# Altium project UCC28180_Power System_V05.PrjPcb
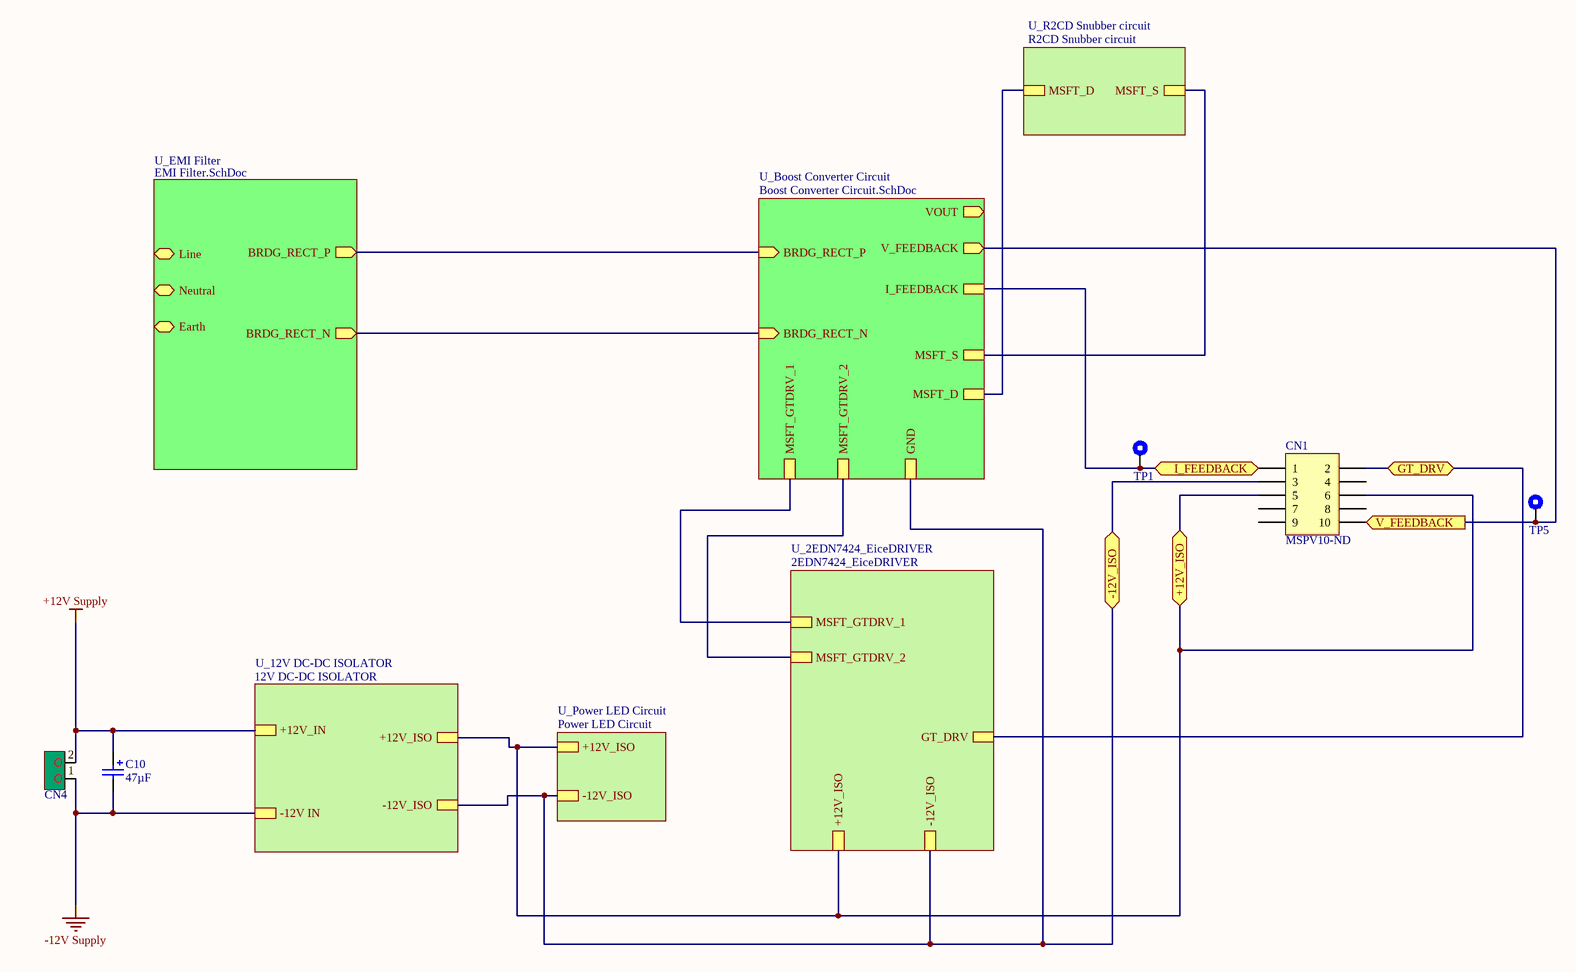
[diagram p0: Top Sheet_Power System.SchDoc]
ApproverName: Approver Name; Author: Name; Document_number: 14-003-DD-_ _-V01; ProjectName/Number: T800, PMLS-14-003; Revision: A; Title: Set the title in project options
3 sheets, 46 parts. Net scope: strictly hierarchical (ports join the sheet entries above them; power ports are local).
Board file: UCC28180_Power Board.PcbDoc
Sheets:
  Top Sheet_Power System.SchDoc
    U_EMI Filter = EMI Filter.SchDoc
    U_Boost Converter Circuit = Boost Converter Circuit.SchDoc

## Sheet Top Sheet_Power System.SchDoc: Set the title in project options
size B; Author: Name; Organization: Altium Limited; Address1: L3, 12a Rodborough Rd; Address2: Frenchs Forest; Address3: NSW; Address4: Australia 2086; Revision: A; SheetNumber: 1; SheetTotal: 1

### Parts
C10  Capacitance: 47µF  [CAPALUM47U]  (hidden comment: ECA-1VM470)
CN1  MSPV10-ND  [MSV10-ND]
CN4  1935776  [CONN_1935776]  (value not drawn)
TP1  5006  [Test Point]  (value not drawn)
TP5  5006  [Test Point]  (value not drawn)

### Sub-sheets
U_2EDN7424_EiceDRIVER = 2EDN7424_EiceDRIVER (file not in this document): MSFT_GTDRV_1, MSFT_GTDRV_2, GT_DRV, -12V_ISO, +12V_ISO
U_12V DC-DC ISOLATOR = 12V DC-DC ISOLATOR (file not in this document): -12V_ISO, +12V_ISO, -12V IN, +12V_IN
U_Boost Converter Circuit = Boost Converter Circuit.SchDoc: BRDG_RECT_P (in), VOUT (out), BRDG_RECT_N (in), V_FEEDBACK (out), I_FEEDBACK, GND, MSFT_GTDRV_1, MSFT_GTDRV_2, MSFT_D, MSFT_S
U_EMI Filter = EMI Filter.SchDoc: BRDG_RECT_P (out), BRDG_RECT_N (out), Line (bidir), Neutral (bidir), Earth (bidir)
U_Power LED Circuit = Power LED Circuit (file not in this document): -12V_ISO, +12V_ISO
U_R2CD Snubber circuit = R2CD Snubber circuit (file not in this document): MSFT_D, MSFT_S

### Ports
+12V_ISO, -12V_ISO, GT_DRV, I_FEEDBACK, V_FEEDBACK (out)

### Nets
+12V Supply: C10.1 CN4.2 ; sheet U_12V DC-DC ISOLATOR/+12V_IN
-12V Supply: C10.2 CN4.1 ; sheet U_12V DC-DC ISOLATOR/-12V IN
LOAD_GND: CN1.3 ; port -12V_ISO, sheet U_Power LED Circuit/-12V_ISO, sheet U_12V DC-DC ISOLATOR/-12V_ISO, sheet U_2EDN7424_EiceDRIVER/-12V_ISO, sheet U_Boost Converter Circuit/GND, sheet U_Boost Converter Circuit/MSFT_S, sheet U_R2CD Snubber circuit/MSFT_S
NetBR1_1: sheet U_EMI Filter/BRDG_RECT_P, sheet U_Boost Converter Circuit/BRDG_RECT_P
NetBR1_4: sheet U_EMI Filter/BRDG_RECT_N, sheet U_Boost Converter Circuit/BRDG_RECT_N
NetCN1_1: CN1.1 TP1.1 ; port I_FEEDBACK, sheet U_Boost Converter Circuit/I_FEEDBACK
NetCN1_2: CN1.2 ; port GT_DRV, sheet U_2EDN7424_EiceDRIVER/GT_DRV
NetCN1_5: CN1.5 CN1.6 ; port +12V_ISO, sheet U_Power LED Circuit/+12V_ISO, sheet U_12V DC-DC ISOLATOR/+12V_ISO, sheet U_2EDN7424_EiceDRIVER/+12V_ISO
NetCN1_10: CN1.10 TP5.1 ; port V_FEEDBACK, sheet U_Boost Converter Circuit/V_FEEDBACK
NetD3_1: sheet U_Boost Converter Circuit/MSFT_D, sheet U_R2CD Snubber circuit/MSFT_D
NetQ1_1: sheet U_2EDN7424_EiceDRIVER/MSFT_GTDRV_2, sheet U_Boost Converter Circuit/MSFT_GTDRV_2
NetQ2_1: sheet U_2EDN7424_EiceDRIVER/MSFT_GTDRV_1, sheet U_Boost Converter Circuit/MSFT_GTDRV_1

Not connected (* = marked no-connect by the designer): CN1 4 7 8 9

### Notes on the sheet
- Title:
- Size:
- B
- Document Number:
- Revision:
- Designer:
- Approval Date:
- Start Date:
- MM/DD/YY
- --/--/--
- Sheet:
- of
- Approver:
- CONFIDENTIAL
- Project Name/Number:

### Library data of the parts
C10 = ECA-1VM470: CAP ALUM 47UF 20% 35V RADIAL; Manufacturer 1: Panasonic Electronic Components; Category 1: Capacitors; Lifetime @ Temp.: 2000 Hrs @ 85°C; Polarization: Polar; Ripple Current: 130mA @ 120Hz; Supplier 1: Digi-Key; Supplier Part Number 1: P5164-ND; Manufacturer Part Number 1: ECA-1VM470; RoHS 1: RoHS Compliant; Description 1: CAP ALUM 47UF 20% 35V RADIAL; Stock 1: 32051; Pricing 1: 1=0.19, 10=0.131, 25=0.0964, 50=0.0788, 100=0.0665, 250=0.05424, 500=0.0455, 1000=0.04025, 5000=0.035 (USD); Packaging: Bulk; Part Status: Active; Tolerance: ±20%; Voltage Rating: 35V; ESR (Equivalent Series Resistance): -; Operating Temperature: -40°C ~ 85°C; Applications: General Purpose; Impedance: -; Lead Spacing: 0.079" (2.00mm); Size / Dimension: 0.197" Dia (5.00mm); Height - Seated (Max): 0.472" (12.00mm); Surface Mount Land Size: -; Mounting Type: Through Hole; Package / Case: Radial, Can; ComponentLink1URL: http://industrial.panasonic.com/www-cgi/jvcr13pz.cgi?E+PZ+3+ABA0012+ECA1VM470+7+WW; ComponentLink1Description: http://industrial.panasonic.com/www-cgi/jvcr13pz.cgi?E+PZ+3+ABA0012+ECA1VM470+7+WW
CN1 = MSPV10-ND: CONN SOCKET PCB VERT 10POS .1"; Manufacturer: 3M; Manufacturer Part Number: 8510-4500PL; Connector Type: Receptacle; Style: Board to Board or Cable; Number of Positions: 10; Number of Positions Loaded: All; Pitch - Mating: 0.100" (2.54mm); Contact Length - Post: 0.110" (2.79mm); Material Flammability Rating: UL94 V-0; Current Rating: 1A; Voltage Rating: 1000V; Supplier 1: Digi-Key; RoHS: RoHS Compliant; Category: Connectors, Interconnects; Stock 1: 448; Pricing 1: 1=3.03, 10=2.904, 100=2.42, 500=2.057, 1000=1.7545, 5000=1.573 (USD); Packaging: Bulk; Part Status: Active; Contact Type: Female Socket; Number of Rows: 2; Row Spacing - Mating: 0.100" (2.54mm); Mounting Type: Through Hole; Termination: Kinked Pin, Solder; Fastening Type: Push-Pull; Contact Finish - Mating: Gold; Contact Finish Thickness - Mating: 12µin (0.30µm); Insulation Color: Gray; Insulation Height: 0.425" (10.80mm); Operating Temperature: -55°C ~ 105°C; Contact Finish - Post: Gold; Mated Stacking Heights: -; Ingress Protection: -; Features: Polarizing Key; Applications: -; Insulation Material: Polybutylene Terephthalate (PBT), Glass Filled; Contact Shape: Square; Contact Material: Copper Alloy; Contact Finish Thickness - Post: Flash; ComponentLink1URL: http://multimedia.3m.com/mws/media/22252O/3mtm-100-in-plr-bmskt-100x-100ctrbmp-strt-sldr-tls-ts0413.pdf; ComponentLink1Description: http://multimedia.3m.com/mws/media/22252O/3mtm-100-in-plr-bmskt-100x-100ctrbmp-strt-sldr-tls-ts0413.pdf; Supplier Part Number 1: MSPV10-ND
CN4 = 1935776: CONN TERM BLOCK 2POS 5.0MM; Manufacturer 1: Phoenix Contact; Category 1: Connectors, Interconnects; Number of Levels: 1; Positions Per Level: 2; Pitch: 0.197" (5.00mm); Mating Orientation: Horizontal with Board; Current: 20A; Voltage: 300V; Wire Gauge: 12-20 AWG; Wire Termination: Screw; Torque - Screw: 0.45-0.5 Nm (3.9-4.4 Lb-In); Screw Thread: M3; Supplier 1: Digi-Key; Supplier Part Number 1: 277-6405-ND; Manufacturer Part Number 1: 1935776; RoHS 1: RoHS Compliant; Description 1: CONN TERM BLOCK 2POS 5.0MM; Stock 1: 5591; Pricing 1: 1=0.43, 10=0.411, 50=0.3928, 100=0.382, 250=0.357, 500=0.32844, 1000=0.2975 (USD); Packaging: Bulk; Part Status: Active; Mounting Type: Through Hole; Features: Interlocking (Side); Color: Green; Operating Temperature: -; Housing Material: Polyamide (PA), Nylon; Contact Material - Plating: -; Clamp Material - Plating: -; Screw Material - Plating: -; ComponentLink1URL: http://media.digikey.com/pdf/Data%20Sheets/Phoenix%20Contact%20PDFs/COMBICON%20Compact%20PT2,5.pdf; ComponentLink1Description: http://media.digikey.com/pdf/Data%20Sheets/Phoenix%20Contact%20PDFs/COMBICON%20Compact%20PT2,5.pdf
TP1 TP5 = 5006: TEST POINT PC COMPACT .063"D BLK; Manufacturer 1: Keystone Electronics; Category 1: Test and Measurement; Plating: Silver; Material - Insulation: Nylon 46, UL 94V-0; Material - Body: Phosphor Bronze; Supplier 1: Digi-Key; Supplier Part Number 1: 36-5006-ND; Manufacturer Part Number 1: 5006; RoHS 1: RoHS Compliant; Description 1: TEST POINT PC COMPACT .063"D BLK; Stock 1: 199444; Pricing 1: 1=0.37, 10=0.316, 50=0.2298, 100=0.2209, 250=0.19832, 500=0.18932, 1000=0.1616, 2500=0.14424, 5000=0.13523 (USD); Packaging: Bulk; Part Status: Active; Type: PC Test Point, Compact; Mounting Type: 0.063" (1.60mm) Hole Diameter; Color: Black; Size / Dimension: 0.125" Dia x 0.220" L (3.18mm x 5.59mm); ComponentLink1URL: http://www.keyelco.com/product-pdf.cfm?p=1314; ComponentLink1Description: http://www.keyelco.com/product-pdf.cfm?p=1314

## Sheet EMI Filter.SchDoc: Set the title in project options
size B; Author: Name; Organization: Altium Limited; Address1: L3, 12a Rodborough Rd; Address2: Frenchs Forest; Address3: NSW; Address4: Australia 2086; Revision: A; SheetNumber: 1; SheetTotal: 1; ModifiedDate: 123
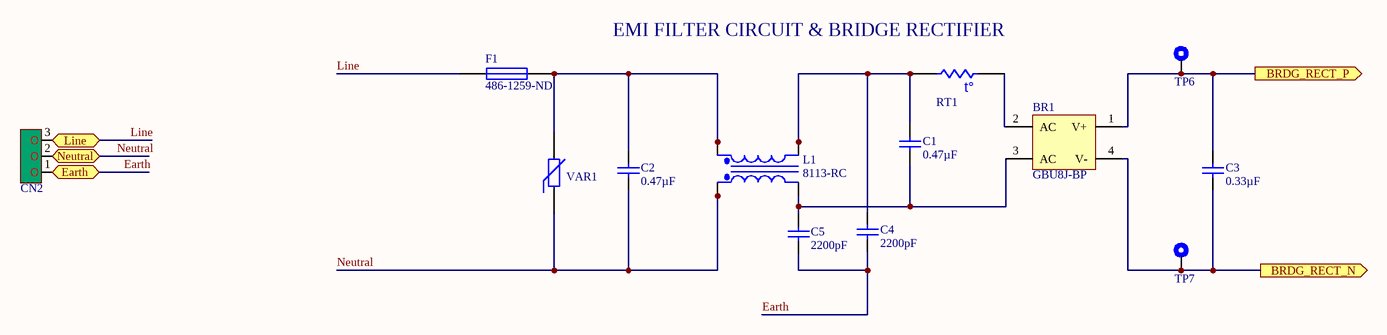
[diagram p1: EMI Filter.SchDoc]

### Parts
BR1  GBU8J-BP  [GBU8J]
C1  Capacitance: 0.47µF  [ECQ-U2A474ML]  (hidden comment: ECQ-U2A474ML)
C2  Capacitance: 0.47µF  [ECQ-U2A474ML]  (hidden comment: ECQ-U2A474ML)
C3  Capacitance: 0.33µF  [CAPFILM0.33U]  (hidden comment: ECQ-U2A334ML)
C4  Capacitance: 2200pF  [CS11-E2GA222MYNS]  (hidden comment: CS11-E2GA222MYNS)
C5  Capacitance: 2200pF  [CS11-E2GA222MYNS]  (hidden comment: CS11-E2GA222MYNS)
CN2  1935789  [CONN_1935789]  (value not drawn)
F1  Supplier Part Number 1: 486-1259-ND  [0031.8211]  (hidden comment: FUSE)
L1  8113-RC  [8113-RC]
RT1  CL-40  [CL-40]  (value not drawn)
TP6  5006  [Test Point]  (value not drawn)
TP7  5006  [Test Point]  (value not drawn)
VAR1  S10K275E2  [S10K275E2]  (value not drawn)

### Ports
BRDG_RECT_N (out), BRDG_RECT_P (out), Earth (bidir), Line (bidir), Neutral (bidir)

### Nets
Earth: C4.1 C5.1 CN2.1 ; port Earth
Line: CN2.3 F1.1 ; port Line
Neutral: C2.2 CN2.2 L1.1(Pri+) VAR1.1 ; port Neutral
NetBR1_1: BR1.1(V+) C3.2 TP6.1 ; port BRDG_RECT_P
NetBR1_2: BR1.2(AC) RT1.1
NetBR1_3: BR1.3(AC) C1.1 C5.2 L1.2(Pri-)
NetBR1_4: BR1.4(V-) C3.1 TP7.1 ; port BRDG_RECT_N
NetC1_2: C1.2 C4.2 L1.3(Sec-) RT1.2
NetC2_1: C2.1 F1.2 L1.4(Sec+) VAR1.2

### Notes on the sheet
- (near RT1) EMI FILTER CIRCUIT & BRIDGE RECTIFIER
- Title:
- Size:
- B
- Document Number:
- Revision:
- Designer:
- Approval Date:
- Start Date:
- MM/DD/YY
- --/--/--
- Sheet:
- of
- Approver:
- CONFIDENTIAL
- Project Name/Number:
- (in symbol CL-40) t°

### Library data of the parts
BR1 = GBU8J-BP: RECT BRIDGE GPP 8A 600V GBU; Manufacturer 1: Micro Commercial Co; Category 1: Discrete Semiconductor Products; Diode Type: Single Phase; Supplier 1: Digi-Key; Supplier Part Number 1: GBU8J-BPMS-ND; RoHS 1: RoHS Compliant; Description 1: RECT BRIDGE GPP 8A 600V GBU; Stock 1: 5723; Pricing 1: 1=0.98, 10=0.868, 25=0.784, 100=0.686, 250=0.602, 500=0.532, 1000=0.42, 2500=0.392, 5000=0.3724 (USD); Packaging: Tube; Part Status: Active; Voltage - Peak Reverse (Max): 600V; Current - DC Forward (If) (Max): 8A; Mounting Type: Through Hole; Package / Case: 4-SIP, GBU; Operating Temperature: -55°C ~ 150°C (TJ); Supplier Device Package: GBU; ComponentLink1URL: http://www.mccsemi.com/up_pdf/GBU8A-GBU8M(GBU).pdf; ComponentLink1Description: http://www.mccsemi.com/up_pdf/GBU8A-GBU8M(GBU).pdf; Manufacturer Part Number 1: GBU8J-BP
C1 C2 = ECQ-U2A474ML: CAP FILM 0.47UF 20% 275VAC RAD; Manufacturer 1: Panasonic Electronic Components; Category 1: Capacitors; Voltage Rating - AC: 275V; Dielectric Material: Polyester, Metallized; Supplier 1: Digi-Key; Supplier Part Number 1: P10734-ND; Manufacturer Part Number 1: ECQ-U2A474ML; RoHS 1: RoHS Compliant; Description 1: CAP FILM 0.47UF 20% 275VAC RAD; Stock 1: 12592; Pricing 1: 1=0.63, 10=0.464, 25=0.3976, 50=0.371, 100=0.318, 250=0.29152, 500=0.25176, 1000=0.212, 5000=0.1855 (USD); Packaging: Bulk; Part Status: Active; Tolerance: ±20%; Voltage Rating - DC: -; ESR (Equivalent Series Resistance): -; Operating Temperature: -40°C ~ 100°C; Mounting Type: Through Hole; Package / Case: Radial; Size / Dimension: 1.004" L x 0.335" W (25.50mm x 8.50mm); Height - Seated (Max): 0.709" (18.00mm); Termination: PC Pins; Lead Spacing: 0.886" (22.50mm); Applications: EMI, RFI Suppression; Features: X2 Safety Rated; ComponentLink1URL: http://industrial.panasonic.com/www-cgi/jvcr13pz.cgi?E+PZ+3+ABD0029+ECQU2A474ML+7+WW; ComponentLink1Description: http://industrial.panasonic.com/www-cgi/jvcr13pz.cgi?E+PZ+3+ABD0029+ECQU2A474ML+7+WW
C3 = ECQ-U2A334ML: CAP FILM 0.33UF 20% 275VAC RAD; Manufacturer 1: Panasonic Electronic Components; Category 1: Capacitors; Voltage Rating - AC: 275V; Dielectric Material: Polyester, Metallized; Supplier 1: Digi-Key; Supplier Part Number 1: P10733-ND; Manufacturer Part Number 1: ECQ-U2A334ML; RoHS 1: RoHS Compliant; Description 1: CAP FILM 0.33UF 20% 275VAC RAD; Stock 1: 584; Pricing 1: 1=0.6, 10=0.428, 25=0.3652, 50=0.3234, 100=0.2816, 250=0.23988, 500=0.2086, 1000=0.17731, 5000=0.15645 (USD); Packaging: Bulk; Part Status: Active; Tolerance: ±20%; Voltage Rating - DC: -; ESR (Equivalent Series Resistance): -; Operating Temperature: -40°C ~ 100°C; Mounting Type: Through Hole; Package / Case: Radial; Size / Dimension: 0.689" L x 0.374" W (17.50mm x 9.50mm); Height - Seated (Max): 0.709" (18.00mm); Termination: PC Pins; Lead Spacing: 0.591" (15.00mm); Applications: EMI, RFI Suppression; Features: X2 Safety Rated; ComponentLink1URL: http://industrial.panasonic.com/www-cgi/jvcr13pz.cgi?E+PZ+3+ABD0029+ECQU2A334ML+7+WW; ComponentLink1Description: http://industrial.panasonic.com/www-cgi/jvcr13pz.cgi?E+PZ+3+ABD0029+ECQU2A334ML+7+WW
C4 C5 = CS11-E2GA222MYNS: CAP CER 2200PF 250VAC RADIAL; Manufacturer 1: TDK Corporation; Category 1: Capacitors; Tolerance: ±20%; Temperature Coefficient: E; Ratings: X1, Y2; Supplier 1: Digi-Key; Supplier Part Number 1: 445-2424-ND; Manufacturer Part Number 1: CS11-E2GA222MYNS; RoHS 1: RoHS Compliant; Description 1: CAP CER 2200PF 250VAC RADIAL; Stock 1: 67; Pricing 1: 1=0.5, 10=0.349, 100=0.2093, 250=0.17436, 500=0.15694, 1000=0.13253, 5000=0.11858, 10000=0.1116, 25000=0.10463 (USD); Packaging: Bulk; Part Status: Obsolete; Voltage - Rated: 250VAC; Operating Temperature: -25°C ~ 105°C; Features: High Voltage; Applications: Safety; Failure Rate: -; Mounting Type: Through Hole; Package / Case: Radial, Disc; Size / Dimension: 0.413" Dia (10.50mm); Height - Seated (Max): 0.571" (14.50mm); Thickness (Max): -; Lead Spacing: 0.295" (7.50mm); Lead Style: Straight; ComponentLink1URL: http://media.digikey.com/pdf/Data%20Sheets/TDK%20PDFs/CS_Series.pdf; ComponentLink1Description: http://media.digikey.com/pdf/Data%20Sheets/TDK%20PDFs/CS_Series.pdf
CN2 = 1935789: CONN TERM BLOCK 3POS 5.0MM; Manufacturer 1: Phoenix Contact; Category 1: Connectors, Interconnects; Number of Levels: 1; Positions Per Level: 3; Pitch: 0.197" (5.00mm); Mating Orientation: Horizontal with Board; Current: 20A; Voltage: 300V; Wire Gauge: 12-20 AWG; Wire Termination: Screw; Torque - Screw: 0.45-0.5 Nm (3.9-4.4 Lb-In); Screw Thread: M3; Supplier 1: Digi-Key; Supplier Part Number 1: 277-6072-ND; Manufacturer Part Number 1: 1935789; RoHS 1: RoHS Compliant; Description 1: CONN TERM BLOCK 3POS 5.0MM; Stock 1: 4677; Pricing 1: 1=0.66, 10=0.633, 50=0.605, 100=0.5885, 250=0.55, 500=0.506, 1000=0.4675 (USD); Packaging: Bulk; Part Status: Active; Mounting Type: Through Hole; Features: Interlocking (Side); Color: Green; Operating Temperature: -; Housing Material: Polyamide (PA), Nylon; Contact Material - Plating: -; Clamp Material - Plating: -; Screw Material - Plating: -; ComponentLink1URL: http://media.digikey.com/pdf/Data%20Sheets/Phoenix%20Contact%20PDFs/COMBICON%20Compact%20PT2,5.pdf; ComponentLink1Description: http://media.digikey.com/pdf/Data%20Sheets/Phoenix%20Contact%20PDFs/COMBICON%20Compact%20PT2,5.pdf
F1 = FUSE: Manufacturer: Schurter Inc.; Fuseholder Type: Block; Fuse Type: Cartridge; For Use With/Related Products: 5mm x 20mm; Number of Circuits: 1; Voltage: 500V; Current Rating: 10A; Supplier 1: Digi-Key; Manufacturer Part Number: 0031.8211; RoHS: RoHS Compliant; Category: Circuit Protection; Stock 1: 17476; Pricing 1: 1=0.69, 50=0.4932, 100=0.4658, 250=0.4384, 500=0.411, 1000=0.3836, 5000=0.36442 (USD); Part Status: Active; Fuse Size: 5mm x 20mm; Mounting Type: PCB; Orientation: Horizontal; Termination Style: PC Pin; Contact Material: Copper Alloy; Contact Finish: Tin; ComponentLink1URL: http://www.schurterinc.com/bundles/snceschurter/epim/_ProdPool_/newDS/en/typ_OGN.pdf; ComponentLink1Description: http://www.schurterinc.com/bundles/snceschurter/epim/_ProdPool_/newDS/en/typ_OGN.pdf
L1 = 8113-RC: CMC 5MH 8.9A 2LN TH; Manufacturer 1: Bourns Inc.; Category 1: Filters; Number of Lines: 2; Inductance @ Frequency: 5mH @ 1kHz; DC Resistance (DCR) (Max): 22 mOhm; Supplier 1: Digi-Key; Supplier Part Number 1: M8908-ND; RoHS 1: RoHS Compliant; Description 1: CMC 5MH 8.9A 2LN TH; Stock 1: 1449; Pricing 1: 1=7.52, 10=6.688, 25=6.1864, 50=5.5594 (USD); Packaging: Tray; Part Status: Active; Filter Type: -; Impedance @ Frequency: -; Current Rating (Max): 8.9A; Voltage Rating - DC: -; Voltage Rating - AC: -; Operating Temperature: -55°C ~ 105°C; Ratings: -; Approvals: -; Features: -; Mounting Type: Through Hole; Size / Dimension: 1.450" L x 0.800" W (36.83mm x 20.32mm); Height (Max): 1.500" (38.10mm); Package / Case: Vertical, 4 PC Pin; ComponentLink1URL: http://www.bourns.com/docs/Product-Datasheets/8100_series.pdf; ComponentLink1Description: http://www.bourns.com/docs/Product-Datasheets/8100_series.pdf; Manufacturer Part Number 1: 8113-RC
RT1 = CL-40: ICL 5 OHM 25% 6A 19.56MM; Manufacturer 1: Amphenol Advanced Sensors; Category 1: Circuit Protection; R @ 25°C: 5 Ohm; R @ Current: 0.11 Ohm; Approvals: UL; Supplier 1: Digi-Key; Supplier Part Number 1: KC004L-ND; Manufacturer Part Number 1: CL-40; RoHS 1: RoHS Compliant; Description 1: ICL 5 OHM 25% 6A 19.56MM; Stock 1: 7009; Pricing 1: 1=1.56, 5=1.512, 10=1.415, 25=1.3664, 50=1.1712, 100=0.976, 250=0.9516, 500=0.8052, 1000=0.7076 (USD); Packaging: Bulk; Part Status: Active; Tolerance: ±25%; Current - Steady State Max: 6A; Diameter: 0.77" (19.56mm); Lead Spacing: 0.328" (8.33mm); ComponentLink1URL: http://www.amphenol-sensors.com/index.php?option=com_edocman&task=document.download&id=90; ComponentLink1Description: http://www.amphenol-sensors.com/index.php?option=com_edocman&task=document.download&id=90
TP6 TP7 = 5006: as TP1 on sheet Top Sheet_Power System; Supplier 1: Digi-Key; Supplier Part Number 1: 36-5006-ND; Manufacturer Part Number 1: 5006; RoHS 1: RoHS Compliant; Description 1: TEST POINT PC COMPACT .063"D BLK; Stock 1: 199444; Pricing 1: 1=0.37, 10=0.316, 50=0.2298, 100=0.2209, 250=0.19832, 500=0.18932, 1000=0.1616, 2500=0.14424, 5000=0.13523 (USD); Packaging: Bulk; Part Status: Active; Type: PC Test Point, Compact; Mounting Type: 0.063" (1.60mm) Hole Diameter; Color: Black; Size / Dimension: 0.125" Dia x 0.220" L (3.18mm x 5.59mm); ComponentLink1URL: http://www.keyelco.com/product-pdf.cfm?p=1314; ComponentLink1Description: http://www.keyelco.com/product-pdf.cfm?p=1314
VAR1 = S10K275E2: VARISTOR 430V 3.5KA DISC 10MM; Manufacturer 1: EPCOS (TDK); Category 1: Circuit Protection; Varistor Voltage (Min): 387V; Varistor Voltage (Max): 473V; Energy: 55J; Number of Circuits: 1; Maximum AC Volts: 275VAC; Maximum DC Volts: 350VDC; Supplier 1: Digi-Key; Supplier Part Number 1: 495-1433-ND; RoHS 1: RoHS Compliant; Description 1: VARISTOR 430V 3.5KA DISC 10MM; Stock 1: 24715; Pricing 1: 1=0.48, 10=0.4, 100=0.3003, 500=0.22022, 1000=0.17017, 5000=0.14515, 10000=0.13514 (USD); Packaging: Bulk; Part Status: Active; Varistor Voltage (Typ): 430V; Current - Surge: 3.5kA; Mounting Type: Through Hole; Package / Case: Disc 10mm; ComponentLink1URL: http://en.tdk.eu/inf/70/db/var_11/SIOV_Leaded_AdvanceD.pdf; ComponentLink1Description: http://en.tdk.eu/inf/70/db/var_11/SIOV_Leaded_AdvanceD.pdf; Manufacturer Part Number 1: S10K275E2

## Sheet Boost Converter Circuit.SchDoc: Set the title in project options
size B; Author: Name; Organization: Altium Limited; Address1: L3, 12a Rodborough Rd; Address2: Frenchs Forest; Address3: NSW; Address4: Australia 2086; Revision: A; SheetNumber: 1; SheetTotal: 1
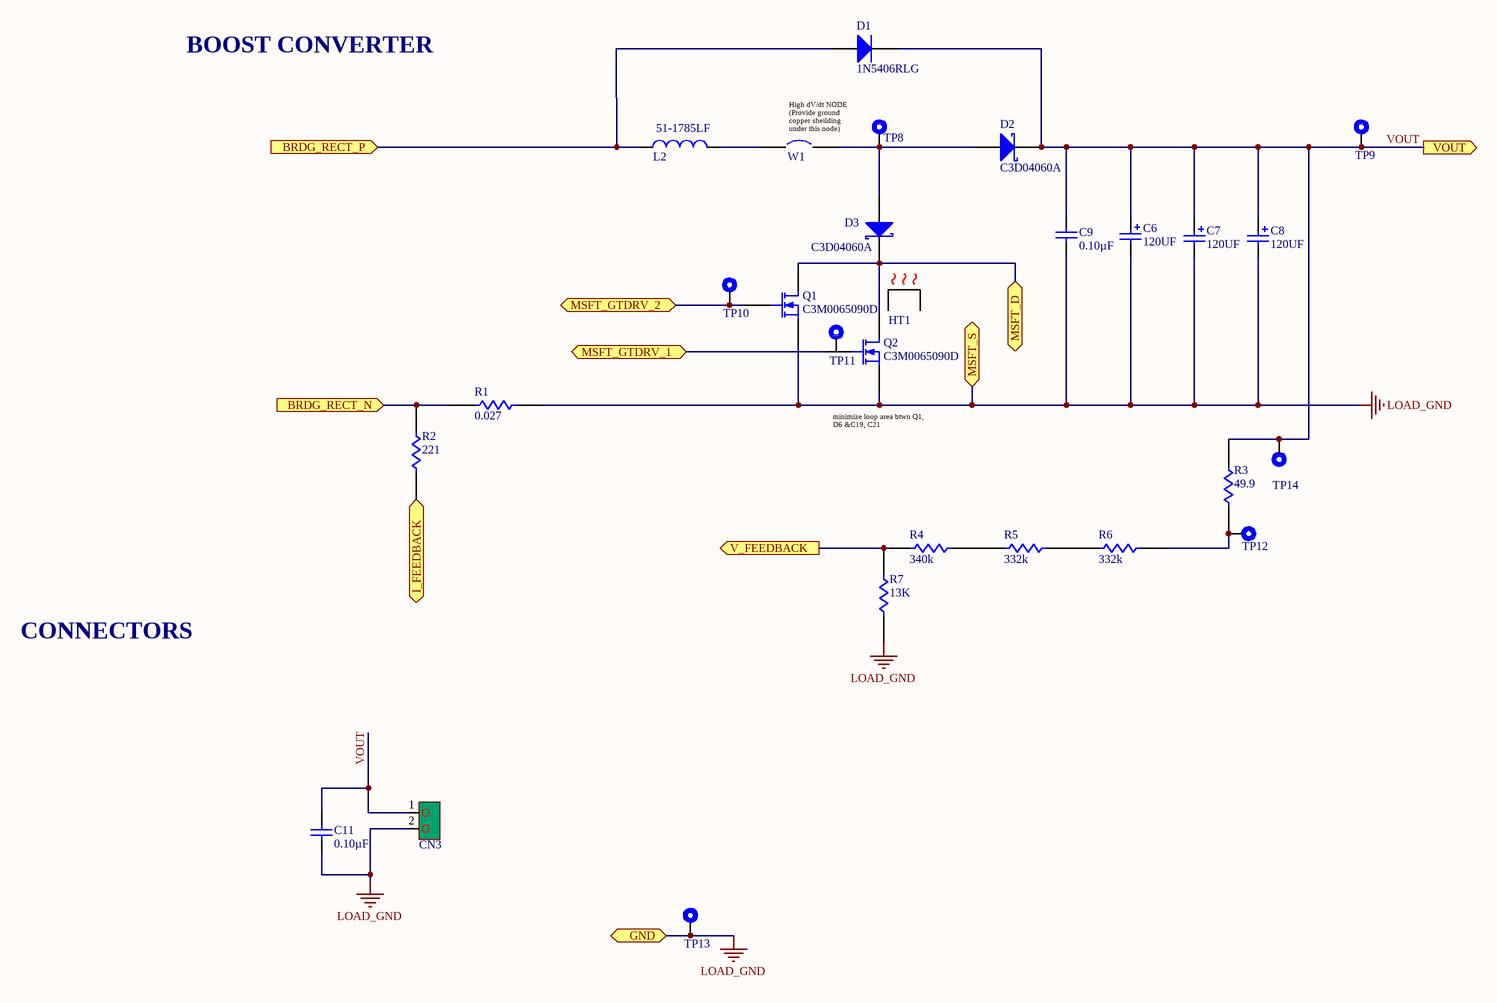
[diagram p2: Boost Converter Circuit.SchDoc]

### Parts
C6  Capacitance: 120UF  [450QXW120MEFC18X31.5]  (hidden comment: 450QXW120MEFC18X31.5)
C7  Capacitance: 120UF  [450QXW120MEFC18X31.5]  (hidden comment: 450QXW120MEFC18X31.5)
C8  Capacitance: 120UF  [450QXW120MEFC18X31.5]  (hidden comment: 450QXW120MEFC18X31.5)
C9  Capacitance: 0.10µF  [CAP1812]  (hidden comment: GRM43DR72J104KW01L)
C11  Capacitance: 0.10µF  [CAP1812]  (hidden comment: GRM43DR72J104KW01L)
CN3  1935776  [CONN_1935776]  (value not drawn)
D1  1N5406RLG  [1N5406-DO201AD]
D2  C3D04060A  [C3D04060A]
D3  C3D04060A  [C3D04060A]
HT1  HT_78245  [HT-78245]  (value not drawn)
L2  51-1785LF  [G-51-185LF]
Q1  C3M0065090D  [TO-247-3]
Q2  C3M0065090D  [TO-247-3]
R1  Resistance: 0.027  [RES2512]  (hidden comment: CRCW2512R0.027)
R2  Resistance: 221  [RES0805_New]  (hidden comment: RC0805FR-07221RL)
R3  Resistance (Ohms): 49.9  [RES1206]  (hidden comment: CRCW120649R9FKEA)
R4  Resistance (Ohms): 340k  [RES0805_New]  (hidden comment: CRCW0805340KFKEA)
R5  Resistance (Ohms): 332k  [RES0805_New]  (hidden comment: CRCW0805332KFKEA)
R6  Resistance (Ohms): 332k  [RES0805_New]  (hidden comment: CRCW0805332KFKEA)
R7  Resistance: 13K  [RES0805_New]  (hidden comment: RC0805FR-0713KL)
TP8  5006  [Test Point]  (value not drawn)
TP9  5006  [Test Point]  (value not drawn)
TP10  5006  [Test Point]  (value not drawn)
TP11  5006  [Test Point]  (value not drawn)
TP12  5006  [Test Point]  (value not drawn)
TP13  5006  [Test Point]  (value not drawn)
TP14  5006  [Test Point]  (value not drawn)
W1  Wire  [Current Sense Wire]  (value not drawn)

### Ports
BRDG_RECT_N (in), BRDG_RECT_P (in), GND, I_FEEDBACK, MSFT_D, MSFT_GTDRV_1, MSFT_GTDRV_2, MSFT_S, V_FEEDBACK (out), VOUT (out)

### Nets
LOAD_GND: C6.2 C7.2 C8.2 C9.1 C11.1 CN3.2 Q1.3(S) Q2.3(S) R1.1 R7.2 TP13.1 ; port GND, port MSFT_S
VOUT: C6.1 C7.1 C8.1 C9.2 C11.2 CN3.1 D1.1(K) D2.1(K) R3.1 TP9.1 TP14.1 ; port VOUT
NetBR1_1: D1.2(A) L2.1 ; port BRDG_RECT_P
NetBR1_4: R1.2 R2.1 ; port BRDG_RECT_N
NetCN1_1: R2.2 ; port I_FEEDBACK
NetCN1_10: R4.2 R7.1 ; port V_FEEDBACK
NetD2_2: D2.2(A) D3.2(A) TP8.1 W1.2
NetD3_1: D3.1(K) Q1.2(D) Q2.2(D) ; port MSFT_D
NetL2_2: L2.2 W1.1
NetQ1_1: Q1.1(G) TP10.1 ; port MSFT_GTDRV_2
NetQ2_1: Q2.1(G) ; port MSFT_GTDRV_1
NetR3_2: R3.2 R6.1 TP12.1
NetR4_1: R4.1 R5.2
NetR5_1: R5.1 R6.2

Not connected (* = marked no-connect by the designer): TP11 1

### Notes on the sheet
- BOOST CONVERTER
- (near W1) High dV/dt NODE (Provide ground copper sheilding under this node)
- minimize loop area btwn Q1, D6 &C19, C21
- CONNECTORS
- Title:
- Size:
- B
- Document Number:
- Revision:
- Designer:
- Approval Date:
- Start Date:
- MM/DD/YY
- --/--/--
- Sheet:
- of
- Approver:
- CONFIDENTIAL
- Project Name/Number:

### Library data of the parts
C9 C11 = GRM43DR72J104KW01L: CAP CER 0.1UF 630V X7R 1812; Manufacturer 1: Murata Electronics North America; Category 1: Capacitors; Tolerance: ±10%; Supplier 1: Digi-Key; Supplier Part Number 1: 490-3518-1-ND; Manufacturer Part Number 1: GRM43DR72J104KW01L; RoHS 1: RoHS Compliant; Description 1: CAP CER 0.1UF 630V X7R 1812; Stock 1: 99604; Pricing 1: 1=0.84, 10=0.803, 50=0.4796, 100=0.3897, 250=0.32372, 500=0.29376 (USD); Packaging: Cut Tape (CT); Part Status: Active; Voltage - Rated: 630V; Temperature Coefficient: X7R; Operating Temperature: -55°C ~ 125°C; Features: -; Ratings: -; Applications: General Purpose; Mounting Type: Surface Mount, MLCC; Package / Case: 1812 (4532 Metric); Size / Dimension: 0.177" L x 0.126" W (4.50mm x 3.20mm); Height - Seated (Max): -; Thickness (Max): 0.087" (2.20mm); Lead Spacing: -; Lead Style: -; ComponentLink1URL: http://www.murata.com/~/media/webrenewal/support/library/catalog/products/capacitor/mlcc/c02e.pdf; ComponentLink1Description: http://www.murata.com/~/media/webrenewal/support/library/catalog/products/capacitor/mlcc/c02e.pdf
CN3 = 1935776: as CN4 on sheet Top Sheet_Power System; Supplier 1: Digi-Key; Supplier Part Number 1: 277-6405-ND; Manufacturer Part Number 1: 1935776; RoHS 1: RoHS Compliant; Description 1: CONN TERM BLOCK 2POS 5.0MM; Stock 1: 5591; Pricing 1: 1=0.43, 10=0.411, 50=0.3928, 100=0.382, 250=0.357, 500=0.32844, 1000=0.2975 (USD); Packaging: Bulk; Part Status: Active; Mounting Type: Through Hole; Features: Interlocking (Side); Color: Green; Operating Temperature: -; Housing Material: Polyamide (PA), Nylon; Contact Material - Plating: -; Clamp Material - Plating: -; Screw Material - Plating: -; ComponentLink1URL: http://media.digikey.com/pdf/Data%20Sheets/Phoenix%20Contact%20PDFs/COMBICON%20Compact%20PT2,5.pdf; ComponentLink1Description: http://media.digikey.com/pdf/Data%20Sheets/Phoenix%20Contact%20PDFs/COMBICON%20Compact%20PT2,5.pdf
D1 = 1N5406RLG: DIODE GEN PURP 600V 3A DO201AD; Manufacturer: ON Semiconductor; Diode Type: Standard; Voltage - Forward (Vf) (Max) @ If: 1V @ 3A; Speed: Standard Recovery >500ns, > 200mA (Io); Current - Reverse Leakage @ Vr: 10µA @ 600V; Supplier 1: Digi-Key; RoHS: RoHS Compliant; Category: Discrete Semiconductor Products; Stock 1: 14400; Pricing 1: 1200=0.0966, 2400=0.08694, 6000=0.08211, 12000=0.07487, 30000=0.07004, 60000=0.06279 (USD); Packaging: Tape & Reel (TR); Part Status: Active; Capacitance @ Vr, F: -; Mounting Type: Through Hole; Package / Case: DO-201AA, DO-27, Axial; Supplier Device Package: DO-201AD; Operating Temperature - Junction: -65°C ~ 150°C; ComponentLink1URL: http://www.onsemi.com/pub_link/Collateral/1N5400-D.PDF; ComponentLink1Description: http://www.onsemi.com/pub_link/Collateral/1N5400-D.PDF; Supplier Part Number 1: 1N5406RLGOSTR-ND; Manufacturer Part Number: 1N5406RLG
D2 D3 = C3D04060A: DIODE SCHOTTKY 600V 4A TO220-2; Manufacturer 1: Cree/Wolfspeed; Category 1: Discrete Semiconductor Products; Diode Type: Silicon Carbide Schottky; Current - Average Rectified (Io): 4A (DC); Voltage - Forward (Vf) (Max) @ If: 1.8V @ 4A; Speed: No Recovery Time > 500mA (Io); Reverse Recovery Time (trr): 0ns; Current - Reverse Leakage @ Vr: 50µA @ 600V; Capacitance @ Vr, F: 251pF @ 0V, 1MHz; Supplier 1: Digi-Key; Supplier Part Number 1: C3D04060A-ND; RoHS 1: RoHS Compliant; Description 1: DIODE SCHOTTKY 600V 4A TO220-2; Stock 1: 1157; Pricing 1: 1=1.94, 100=1.62, 500=1.39, 1000=1.2125 (USD); Packaging: Tube; Part Status: Active; Voltage - DC Reverse (Vr) (Max): 600V; Mounting Type: Through Hole; Package / Case: TO-220-2; Supplier Device Package: TO-220-2; Operating Temperature - Junction: -55°C ~ 175°C; ComponentLink1URL: http://www.wolfspeed.com/media/downloads/845/C3D04060A.pdf; ComponentLink1Description: http://www.wolfspeed.com/media/downloads/845/C3D04060A.pdf; Manufacturer Part Number 1: C3D04060A
L2 = 51-1785LF: Manufacturer: Gowanda Electronics
Q1 Q2 = C3M0065090D: MOSFET N-CH 900V 36A TO247-3; Manufacturer 1: Cree/Wolfspeed; Category 1: Discrete Semiconductor Products; FET Type: N-Channel; Current - Continuous Drain (Id) @ 25°C: 36A (Tc); Drive Voltage (Max Rds On,  Min Rds On): 15V; Vgs(th) (Max) @ Id: 2.1V @ 5mA; Gate Charge (Qg) (Max) @ Vgs: 30.4nC @ 15V; Input Capacitance (Ciss) (Max) @ Vds: 660pF @ 600V; Vgs (Max): +18V, -8V; Power Dissipation (Max): 125W (Tc); Rds On (Max) @ Id, Vgs: 78 mOhm @ 20A, 15V; Supplier 1: Digi-Key; Supplier Part Number 1: C3M0065090D-ND; RoHS 1: RoHS Compliant; Description 1: MOSFET N-CH 900V 36A TO247-3; Stock 1: 4348; Pricing 1: 1=9.98, 100=9.62, 500=9.375 (USD); Packaging: Tube; Part Status: Active; Technology: SiCFET (Silicon Carbide); Drain to Source Voltage (Vdss): 900V; FET Feature: -; Operating Temperature: -55°C ~ 150°C (TJ); Mounting Type: Through Hole; Supplier Device Package: TO-247-3; Package / Case: TO-247-3; ComponentLink1URL: http://www.wolfspeed.com/media/downloads/176/C3M0065090D.pdf; ComponentLink1Description: http://www.wolfspeed.com/media/downloads/176/C3M0065090D.pdf; Manufacturer Part Number 1: C3M0065090D
R2 = RC0805FR-07221RL: RES SMD 221 OHM 1% 1/8W 0805; Manufacturer: Yageo; Power (Watts): 0.125W, 1/8W; Temperature Coefficient: ±100ppm/°C; Supplier 1: Digi-Key; Manufacturer Part Number: RC0805FR-07221RL; RoHS: RoHS Compliant; Category: Resistors; Stock 1: 823293; Pricing 1: 1=0.1, 10=0.022, 100=0.0088, 1000=0.00396, 2500=0.00344 (USD); Packaging: Cut Tape (CT); Part Status: Active; Tolerance: ±1%; Composition: Thick Film; Features: Moisture Resistant; Operating Temperature: -55°C ~ 155°C; Package / Case: 0805 (2012 Metric); Supplier Device Package: 0805; Size / Dimension: 0.079" L x 0.049" W (2.00mm x 1.25mm); Height - Seated (Max): 0.024" (0.60mm); Failure Rate: -; ComponentLink1URL: http://www.yageo.com/documents/recent/PYu-RC_Group_51_RoHS_L_7.pdf; ComponentLink1Description: http://www.yageo.com/documents/recent/PYu-RC_Group_51_RoHS_L_7.pdf; Supplier Part Number 1: 311-221CRCT-ND
R3 = CRCW120649R9FKEA: RES SMD 49.9 OHM 1% 1/4W 1206; Manufacturer 1: Vishay Dale; Category 1: Resistors; Power (Watts): 0.25W, 1/4W; Temperature Coefficient: ±100ppm/°C; Supplier 1: Digi-Key; Supplier Part Number 1: 541-49.9FCT-ND; Manufacturer Part Number 1: CRCW120649R9FKEA; RoHS 1: RoHS Compliant; Description 1: RES SMD 49.9 OHM 1% 1/4W 1206; Stock 1: 25160; Pricing 1: 1=0.1, 10=0.054, 25=0.0392, 50=0.03, 100=0.0221, 250=0.01684, 500=0.01346, 1000=0.00991 (USD); Packaging: Cut Tape (CT); Part Status: Active; Tolerance: ±1%; Composition: Thick Film; Features: Automotive AEC-Q200; Operating Temperature: -55°C ~ 155°C; Package / Case: 1206 (3216 Metric); Supplier Device Package: 1206; Size / Dimension: 0.126" L x 0.063" W (3.20mm x 1.60mm); Height - Seated (Max): 0.024" (0.60mm); Number of Terminations: 2; Failure Rate: -; ComponentLink1URL: http://www.vishay.com/docs/20035/dcrcwe3.pdf; ComponentLink1Description: http://www.vishay.com/docs/20035/dcrcwe3.pdf
R4 = CRCW0805340KFKEA: RES SMD 340K OHM 1% 1/8W 0805; Manufacturer 1: Vishay Dale; Category 1: Resistors; Power (Watts): 0.125W, 1/8W; Temperature Coefficient: ±100ppm/°C; Supplier 1: Digi-Key; Supplier Part Number 1: 541-340KCCT-ND; Manufacturer Part Number 1: CRCW0805340KFKEA; RoHS 1: RoHS Compliant; Description 1: RES SMD 340K OHM 1% 1/8W 0805; Stock 1: 2950; Pricing 1: 1=0.1, 10=0.04, 25=0.0288, 50=0.022, 100=0.0162, 250=0.01236, 500=0.0099, 1000=0.00729 (USD); Packaging: Cut Tape (CT); Part Status: Active; Tolerance: ±1%; Composition: Thick Film; Features: Automotive AEC-Q200; Operating Temperature: -55°C ~ 155°C; Package / Case: 0805 (2012 Metric); Supplier Device Package: 0805; Size / Dimension: 0.079" L x 0.049" W (2.00mm x 1.25mm); Height - Seated (Max): 0.020" (0.50mm); Number of Terminations: 2; Failure Rate: -; ComponentLink1URL: http://www.vishay.com/docs/20035/dcrcwe3.pdf; ComponentLink1Description: http://www.vishay.com/docs/20035/dcrcwe3.pdf
R5 R6 = CRCW0805332KFKEA: RES SMD 332K OHM 1% 1/8W 0805; Manufacturer 1: Vishay Dale; Category 1: Resistors; Power (Watts): 0.125W, 1/8W; Temperature Coefficient: ±100ppm/°C; Supplier 1: Digi-Key; Supplier Part Number 1: 541-332KCCT-ND; Manufacturer Part Number 1: CRCW0805332KFKEA; RoHS 1: RoHS Compliant; Description 1: RES SMD 332K OHM 1% 1/8W 0805; Stock 1: 14758; Pricing 1: 1=0.1, 10=0.04, 25=0.0288, 50=0.022, 100=0.0162, 250=0.01236, 500=0.0099, 1000=0.00729 (USD); Packaging: Cut Tape (CT); Part Status: Active; Tolerance: ±1%; Composition: Thick Film; Features: Automotive AEC-Q200; Operating Temperature: -55°C ~ 155°C; Package / Case: 0805 (2012 Metric); Supplier Device Package: 0805; Size / Dimension: 0.079" L x 0.049" W (2.00mm x 1.25mm); Height - Seated (Max): 0.020" (0.50mm); Number of Terminations: 2; Failure Rate: -; ComponentLink1URL: http://www.vishay.com/docs/20035/dcrcwe3.pdf; ComponentLink1Description: http://www.vishay.com/docs/20035/dcrcwe3.pdf
R7 = RC0805FR-0713KL: RES SMD 13K OHM 1% 1/8W 0805; Manufacturer: Yageo; Power (Watts): 0.125W, 1/8W; Temperature Coefficient: ±100ppm/°C; Supplier 1: Digi-Key; Manufacturer Part Number: RC0805FR-0713KL; RoHS: RoHS Compliant; Category: Resistors; Stock 1: 171259; Pricing 1: 1=0.1, 10=0.022, 100=0.0088, 1000=0.00396, 2500=0.00344 (USD); Packaging: Cut Tape (CT); Part Status: Active; Tolerance: ±1%; Composition: Thick Film; Features: Moisture Resistant; Operating Temperature: -55°C ~ 155°C; Package / Case: 0805 (2012 Metric); Supplier Device Package: 0805; Size / Dimension: 0.079" L x 0.049" W (2.00mm x 1.25mm); Height - Seated (Max): 0.024" (0.60mm); Failure Rate: -; ComponentLink1URL: http://www.yageo.com/documents/recent/PYu-RC_Group_51_RoHS_L_7.pdf; ComponentLink1Description: http://www.yageo.com/documents/recent/PYu-RC_Group_51_RoHS_L_7.pdf; Supplier Part Number 1: 311-13.0KCRCT-ND
TP8-TP14 = 5006: as TP1 on sheet Top Sheet_Power System; Supplier 1: Digi-Key; Supplier Part Number 1: 36-5006-ND; Manufacturer Part Number 1: 5006; RoHS 1: RoHS Compliant; Description 1: TEST POINT PC COMPACT .063"D BLK; Stock 1: 199444; Pricing 1: 1=0.37, 10=0.316, 50=0.2298, 100=0.2209, 250=0.19832, 500=0.18932, 1000=0.1616, 2500=0.14424, 5000=0.13523 (USD); Packaging: Bulk; Part Status: Active; Type: PC Test Point, Compact; Mounting Type: 0.063" (1.60mm) Hole Diameter; Color: Black; Size / Dimension: 0.125" Dia x 0.220" L (3.18mm x 5.59mm); ComponentLink1URL: http://www.keyelco.com/product-pdf.cfm?p=1314; ComponentLink1Description: http://www.keyelco.com/product-pdf.cfm?p=1314

## Nets that join several sheets
LOAD_GND: Top Sheet_Power System (CN1.3), Boost Converter Circuit (11 pins)
NetBR1_1: EMI Filter (BR1.1 C3.2 TP6.1), Boost Converter Circuit (D1.2 L2.1)
NetBR1_4: EMI Filter (BR1.4 C3.1 TP7.1), Boost Converter Circuit (R1.2 R2.1)
NetCN1_1: Top Sheet_Power System (CN1.1 TP1.1), Boost Converter Circuit (R2.2)
NetCN1_10: Top Sheet_Power System (CN1.10 TP5.1), Boost Converter Circuit (R4.2 R7.1)